# EasyEDA schematic SCH_Static-stand-for-thrust-and-torque.json
TITLE: Sheet_1; REV: 1.0; Date: 2025-02-21; Sheet: 1/1; Drawn By: Simone Redaelli; Company: Fly Mi - EPC
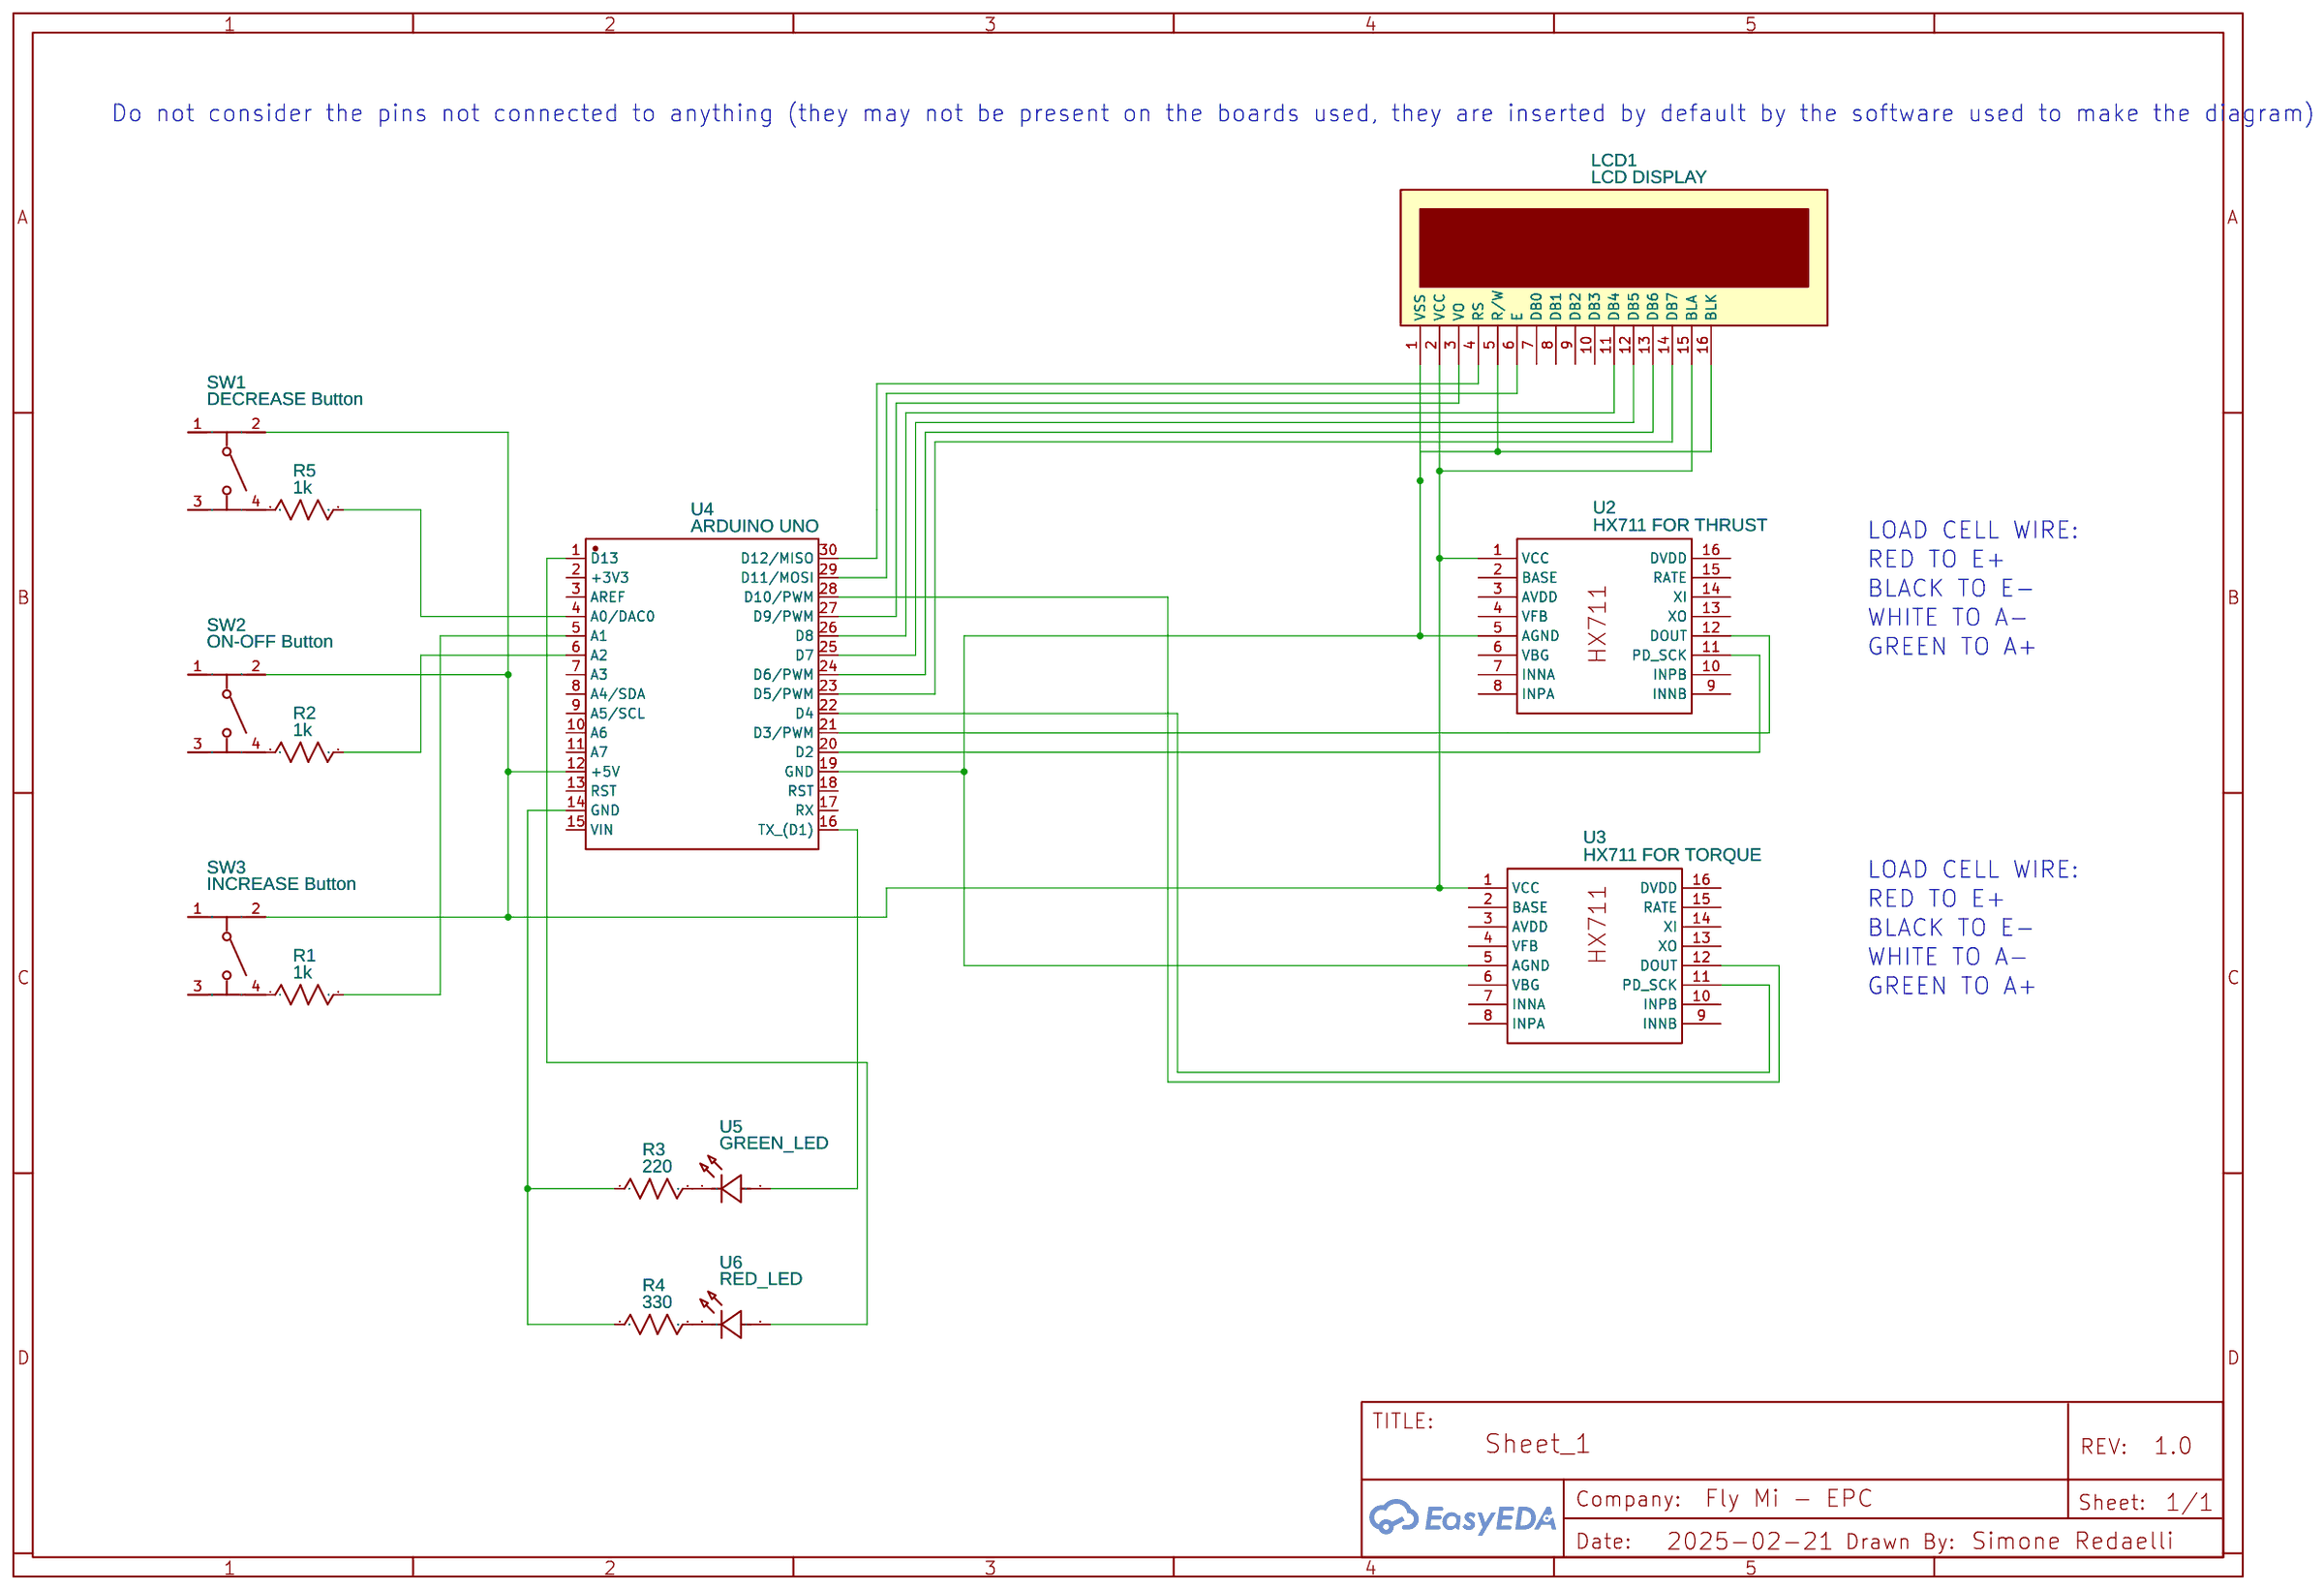
[diagram p0: schematic sheet]

## Parts
LCD1  LCD DISPLAY  [LCD1602]
R1  1k  [R0603]
R2  1k  [R0603]
R3  220  [R0603]
R4  330  [R0603]
R5  1k  [R0603]
SW1  DECREASE Button  [SW-SMD_4P-L4.5-W4.5-P3.00-LS7.0]
SW2  ON-OFF Button  [SW-SMD_4P-L4.5-W4.5-P3.00-LS7.0]
SW3  INCREASE Button  [SW-SMD_4P-L4.5-W4.5-P3.00-LS7.0]
U2  HX711 FOR THRUST  [SOP-16_L10.0-W3.9-P1.27-LS6.0-BL]
U3  HX711 FOR TORQUE  [SOP-16_L10.0-W3.9-P1.27-LS6.0-BL]
U4  ARDUINO UNO  [MOD-TH_ABX00028]
U5  GREEN_LED  [LED0603-RD_RED]
U6  RED_LED  [LED0603-RD_RED]

## Library data of the parts
LCD1 = LCD1602: Manufacturer: LONTECH(厦门龙特); Manufacturer Part: LCM1602K-NSW-BBW; Supplier Part: C83275; Supplier: LCSC; Contributor: LCEDA_Lib
R1-R5 = R_0603_US: Contributor: LCEDA_Lib
SW1-SW3 = Button-SMD-4.5x4.5x4.8: Supplier: LCSC; Manufacturer: BBJ; Manufacturer Part: 4.5*4.5*4.8 Plastic head,260G, 0.25mm,SMD; Supplier Part: C71850; JLCPCB Part Class: Extended Part
U2 U3 = HX711: Supplier: LCSC; Manufacturer: AVIA(海芯科技); Supplier Part: C43656; JLCPCB Part Class: Extended Part
U4 = ABX00028: Supplier: LCSC; Supplier Part: C21303176; Manufacturer: arduino; Contributor: lcsc
U5 U6 = 0603: Contributor: lcsc; Convert to PCB: Yes; Add into BOM: Yes; Supplier: LCSC; Supplier Part: C9900014602; Manufacturer: null; JLCPCB Part Class: Extended Part

## Nets
Net-(LCD1-1): LCD1.1(VSS) LCD1.5(R/W) LCD1.16(BLK) U2.5(AGND) U3.5(AGND) U4.19(GND)
Net-(LCD1-2): LCD1.2(VCC) LCD1.15(BLA) SW1.2 SW2.2 SW3.2 U2.1(VCC) U3.1(VCC) U4.12(+5V)
Net-(LCD1-3): LCD1.3(VO) U4.27(D9/PWM)
Net-(LCD1-4): LCD1.4(RS) U4.30(D12/MISO)
Net-(LCD1-6): LCD1.6(E) U4.29(D11/MOSI)
Net-(LCD1-11): LCD1.11(DB4) U4.26(D8)
Net-(LCD1-12): LCD1.12(DB5) U4.25(D7)
Net-(LCD1-13): LCD1.13(DB6) U4.24(D6/PWM)
Net-(LCD1-14): LCD1.14(DB7) U4.23(D5/PWM)
Net-(R1-1): R1.1 SW3.4
Net-(R1-2): R1.2 U4.5(A1)
Net-(R2-1): R2.1 SW2.4
Net-(R2-2): R2.2 U4.6(A2)
Net-(R3-1): R3.1 R4.1 U4.14(GND)
Net-(R3-2): R3.2 U5.1(K)
Net-(R4-2): R4.2 U6.1(K)
Net-(R5-1): R5.1 SW1.4
Net-(R5-2): R5.2 U4.4(A0/DAC0)
Net-(U2-11): U2.11(PD_SCK) U4.20(D2)
Net-(U2-12): U2.12(DOUT) U4.21(D3/PWM)
Net-(U3-11): U3.11(PD_SCK) U4.22(D4)
Net-(U3-12): U3.12(DOUT) U4.28(D10/PWM)
Net-(U4-1): U4.1(D13) U6.2(A)
Net-(U4-16): U4.16(TX (D1)) U5.2(A)

Not connected (* = marked no-connect by the designer): LCD1 7(DB0) 8(DB1) 9(DB2) 10(DB3); SW1 1 3; SW2 1 3; SW3 1 3; U2 2(BASE) 3(AVDD) 4(VFB) 6(VBG) 7(INNA) 8(INPA) 9(INNB) 10(INPB) 13(XO) 14(XI) 15(RATE) 16(DVDD); U3 2(BASE) 3(AVDD) 4(VFB) 6(VBG) 7(INNA) 8(INPA) 9(INNB) 10(INPB) 13(XO) 14(XI) 15(RATE) 16(DVDD); U4 2(+3V3) 3(AREF) 7(A3) 8(A4/SDA) 9(A5/SCL) 10(A6) 11(A7) 13(RST) 15(VIN) 17(RX) 18(RST)

## Notes on the sheet
- Do not consider the pins not connected to anything (they may not be present on the boards used, they are inserted by default by the software used to make the diagram)
- LOAD CELL WIRE:
- RED TO E+
- BLACK TO E-
- WHITE TO A-
- GREEN TO A+
- LOAD CELL WIRE:
- RED TO E+
- BLACK TO E-
- WHITE TO A-
- GREEN TO A+
